# Altium schematic sheet DC_Link.SchDoc
size A4
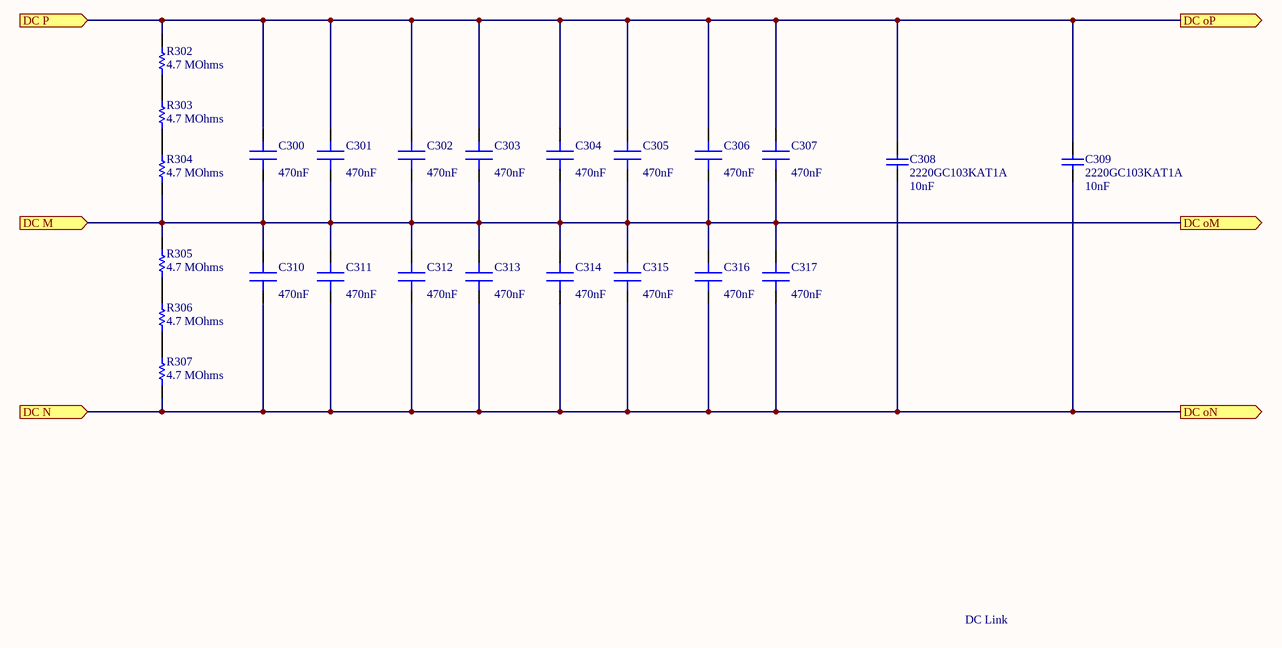
[diagram p0: DC_Link.SchDoc]

## Parts
C300  Capacitance: 470nF  [C_1812_CKG45NX7T2J474M500JH]  (hidden comment: CKG45NX7T2J474M500JH)
C301  Capacitance: 470nF  [C_1812_CKG45NX7T2J474M500JH]  (hidden comment: CKG45NX7T2J474M500JH)
C302  Capacitance: 470nF  [C_1812_CKG45NX7T2J474M500JH]  (hidden comment: CKG45NX7T2J474M500JH)
C303  Capacitance: 470nF  [C_1812_CKG45NX7T2J474M500JH]  (hidden comment: CKG45NX7T2J474M500JH)
C304  Capacitance: 470nF  [C_1812_CKG45NX7T2J474M500JH]  (hidden comment: CKG45NX7T2J474M500JH)
C305  Capacitance: 470nF  [C_1812_CKG45NX7T2J474M500JH]  (hidden comment: CKG45NX7T2J474M500JH)
C306  Capacitance: 470nF  [C_1812_CKG45NX7T2J474M500JH]  (hidden comment: CKG45NX7T2J474M500JH)
C307  Capacitance: 470nF  [C_1812_CKG45NX7T2J474M500JH]  (hidden comment: CKG45NX7T2J474M500JH)
C308  2220GC103KAT1A  Capacitance: 10nF  [CAPC5750X330X64LL40T39]
C309  2220GC103KAT1A  Capacitance: 10nF  [CAPC5750X330X64LL40T39]
C310  Capacitance: 470nF  [C_1812_CKG45NX7T2J474M500JH]  (hidden comment: CKG45NX7T2J474M500JH)
C311  Capacitance: 470nF  [C_1812_CKG45NX7T2J474M500JH]  (hidden comment: CKG45NX7T2J474M500JH)
C312  Capacitance: 470nF  [C_1812_CKG45NX7T2J474M500JH]  (hidden comment: CKG45NX7T2J474M500JH)
C313  Capacitance: 470nF  [C_1812_CKG45NX7T2J474M500JH]  (hidden comment: CKG45NX7T2J474M500JH)
C314  Capacitance: 470nF  [C_1812_CKG45NX7T2J474M500JH]  (hidden comment: CKG45NX7T2J474M500JH)
C315  Capacitance: 470nF  [C_1812_CKG45NX7T2J474M500JH]  (hidden comment: CKG45NX7T2J474M500JH)
C316  Capacitance: 470nF  [C_1812_CKG45NX7T2J474M500JH]  (hidden comment: CKG45NX7T2J474M500JH)
C317  Capacitance: 470nF  [C_1812_CKG45NX7T2J474M500JH]  (hidden comment: CKG45NX7T2J474M500JH)
R302  value 4.7 MOhms  [RESC3216X60X45LL10T20]  (hidden comment: CRCW12064M70FKEA)
R303  value 4.7 MOhms  [RESC3216X60X45LL10T20]  (hidden comment: CRCW12064M70FKEA)
R304  value 4.7 MOhms  [RESC3216X60X45LL10T20]  (hidden comment: CRCW12064M70FKEA)
R305  value 4.7 MOhms  [RESC3216X60X45LL10T20]  (hidden comment: CRCW12064M70FKEA)
R306  value 4.7 MOhms  [RESC3216X60X45LL10T20]  (hidden comment: CRCW12064M70FKEA)
R307  value 4.7 MOhms  [RESC3216X60X45LL10T20]  (hidden comment: CRCW12064M70FKEA)

## Ports
DC M (in), DC N (in), DC oM (out), DC oN (out), DC oP (out), DC P (in)

## Nets
DC M: C300.1 C301.1 C302.1 C303.1 C304.1 C305.1 C306.1 C307.1 C310.2 C311.2 C312.2 C313.2 C314.2 C315.2 C316.2 C317.2 R304.2 R305.1 ; port DC M, port DC oM
DC N: C308.1 C309.1 C310.1 C311.1 C312.1 C313.1 C314.1 C315.1 C316.1 C317.1 R307.2 ; port DC N, port DC oN
DC oP: C300.2 C301.2 C302.2 C303.2 C304.2 C305.2 C306.2 C307.2 C308.2 C309.2 R302.1 ; port DC P, port DC oP
NetR302_2: R302.2 R303.1
NetR303_2: R303.2 R304.1
NetR305_2: R305.2 R306.1
NetR306_2: R306.2 R307.1

## Notes on the sheet
- DC Link

## Library data of the parts
C300-C307 C310-C317 = CKG45NX7T2J474M500JH: TDK         CKG45NX7T2J474M500JH             SMD Multilayer Ceramic Capacitor, 1812 [4532 Metric], 0.47 F, 630 V,  20%, X7T, CKG Series; Voltage Rating: 630V; Supplier 1: Digi-Key; Manufacturer: TDK; Manufacturer Part Number: CKG45NX7T2J474M500JH; RoHS: Yes; Category: Ceramic Capacitors; Stock 1: 1650; Pricing 1: 1=4,71000, 10=3,79500, 100=2,96010, 500=2,20110 (USD); Mount: Surface Mount; Case/Package: SMD/SMT; Case Code (Imperial): 1812; Case Code (Metric): 4532; Min Operating Temperature: -55°C; Max Operating Temperature: 125°C; Tolerance: 20%; Packaging: Tape and Reel; Voltage Rating (DC): 630V; Dielectric: X7T; Termination: Metal; Package Quantity: 1; Composition: Ceramic; Length: 5mm; Height: 5mm; Width: 0.138inch; Thickness: 0.217inch; Depth: 3.5mm; REACH SVHC: No SVHC; ComponentLink1URL: https://datasheet.ciiva.com/24221/ckg45nx7t2j474m500jh-24221101.pdf?src-supplier=Mouser; ComponentLink1Description: https://datasheet.ciiva.com/24221/ckg45nx7t2j474m500jh-24221101.pdf?src-supplier=Mouser; ComponentLink2URL: https://datasheet.ciiva.com/6253/mlcc-commercial-megacap-en-6253704.pdf?src-supplier=Digi-Key; ComponentLink2Description: https://datasheet.ciiva.com/6253/mlcc-commercial-megacap-en-6253704.pdf?src-supplier=Digi-Key; ComponentLink3URL: https://datasheet.ciiva.com/6253/mlcc-commercial-megacap-en-6253702.pdf?src-supplier=Digi-Key; ComponentLink3Description: https://datasheet.ciiva.com/6253/mlcc-commercial-megacap-en-6253702.pdf?src-supplier=Digi-Key; Supplier Part Number 1: 445-7101-1-ND
C308 C309 = CMP-2000-05534-1: Chip Capacitor, 10000 pF, +/- 10%, 2000 V, -55 to 125 degC, 2220 (5750 Metric), RoHS, Tape and Reel; Manufacturer: AVX; Dielectric: X7R; Rated Voltage: 2000V; Datasheet URL: http://datasheets.avx.com/HighVoltageAutoMLCC.pdf; Case Size/Dimension: 2220; Manufacturer URL: http://www.avx.com/; Mounting Technology: SurfaceMount; Package Reference: 2220; Datasheet Version: 06/2016; Tolerance (%): ±10%; Package Description: 2-Pin Surface Mount Device, Body 5.7 x 5 mm
R302-R307 = CMP-2003-02243-1: Manufacturer: Vishay Dale; Part Number: CRCW12064M70FKEA; Package: 1206